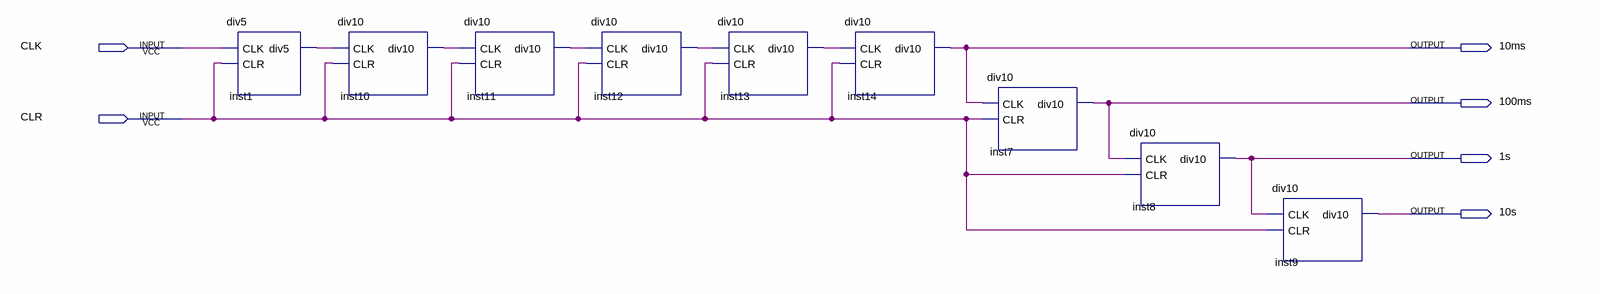
[diagram p0: schematic sheet]
// Quartus schematic divider.bdf as structural Verilog: 9 symbols, 6 pins
module divider (
  input  CLK,
  input  CLR,
  output \10ms ,
  output \100ms ,
  output \1s ,
  output \10s 
);

  wire inst1_div5, inst10_div10, inst11_div10, inst12_div10, inst13_div10;

  div5 inst1 (.CLK(CLK), .CLR(CLR), .div5(inst1_div5));
  div10 inst10 (.CLK(inst1_div5), .CLR(CLR), .div10(inst10_div10));
  div10 inst11 (.CLK(inst10_div10), .CLR(CLR), .div10(inst11_div10));
  div10 inst12 (.CLK(inst11_div10), .CLR(CLR), .div10(inst12_div10));
  div10 inst13 (.CLK(inst12_div10), .CLR(CLR), .div10(inst13_div10));
  div10 inst14 (.CLK(inst13_div10), .CLR(CLR), .div10(\10ms ));
  div10 inst7 (.CLK(\10ms ), .CLR(CLR), .div10(\100ms ));
  div10 inst8 (.CLK(\100ms ), .CLR(CLR), .div10(\1s ));
  div10 inst9 (.CLK(\1s ), .CLR(CLR), .div10(\10s ));
endmodule
